# Altium schematic sheet HV PDU.SchDoc
size Letter; DescLong2_DescShort: -
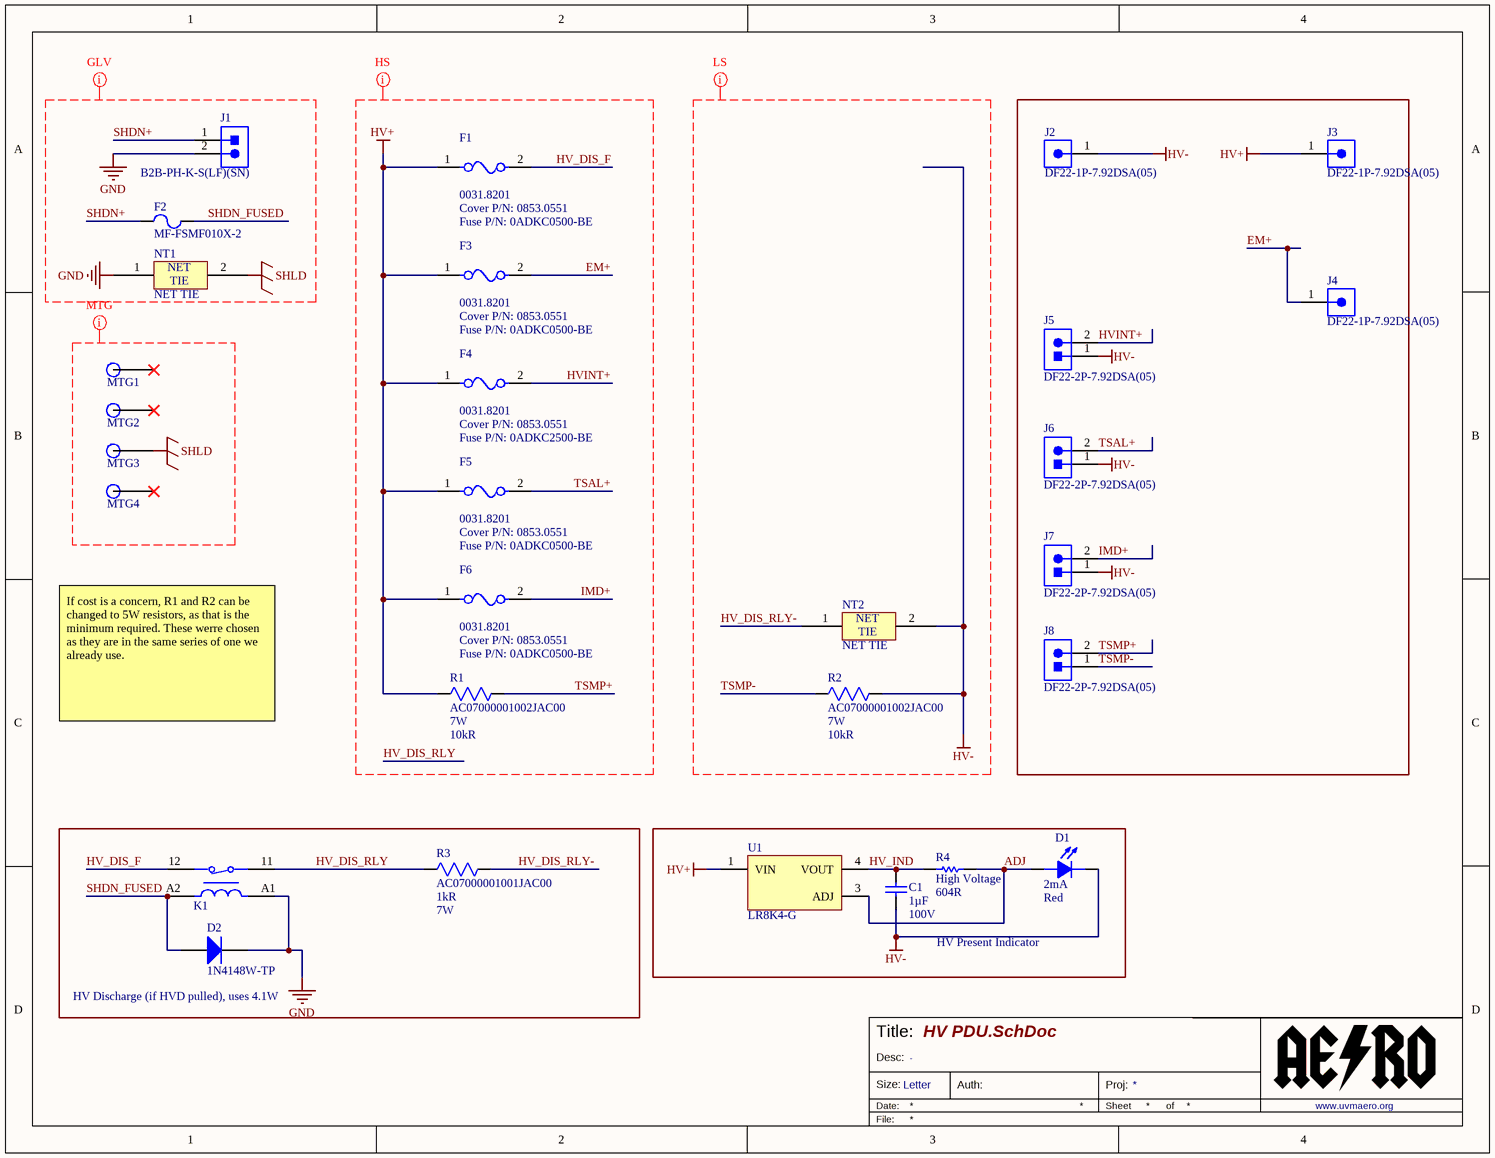
[diagram p0: HV PDU.SchDoc]

## Parts
C1  Capacitance: 1µF  Voltage - Rated: 100V  [CAPC2013X145X20ML20]  (hidden comment: C2012X7S2A105K125AB)
D1  Test Current: 2mA  Color: Red  [LED_5MM]  (hidden comment: WP7113LSECK/J3)
D2  1N4148W-TP  [MCC-SOD123_V]
F1  0031.8201  Cover P/N: 0853.0551  Fuse P/N: 0ADKC0500-BE  [Schurter_0031.8201_ASM]
F2  MF-FSMF010X-2  [MF-FSMF]
F3  0031.8201  Cover P/N: 0853.0551  Fuse P/N: 0ADKC0500-BE  [Schurter_0031.8201_ASM]
F4  0031.8201  Cover P/N: 0853.0551  Fuse P/N: 0ADKC2500-BE  [Schurter_0031.8201_ASM]
F5  0031.8201  Cover P/N: 0853.0551  Fuse P/N: 0ADKC0500-BE  [Schurter_0031.8201_ASM]
F6  0031.8201  Cover P/N: 0853.0551  Fuse P/N: 0ADKC0500-BE  [Schurter_0031.8201_ASM]
J1  B2B-PH-K-S(LF)(SN)  [JST_Sales_America_Inc._B2B-PH-K-S_LF_SN_0]
J2  DF22-1P-7.92DSA(05)  [DF22-1P-7.92DSA(05)]
J3  DF22-1P-7.92DSA(05)  [DF22-1P-7.92DSA(05)]
J4  DF22-1P-7.92DSA(05)  [DF22-1P-7.92DSA(05)]
J5  DF22-2P-7.92DSA(05)  [DF22-2P-7.92DSA_05_0]
J6  DF22-2P-7.92DSA(05)  [DF22-2P-7.92DSA_05_0]
J7  DF22-2P-7.92DSA(05)  [DF22-2P-7.92DSA_05_0]
J8  DF22-2P-7.92DSA(05)  [DF22-2P-7.92DSA_05_0]
K1  1393225-5  [RY553012]  (value not drawn)
MTG1  PCB MTG M3 HV  [MTG-M3-HV]  (value not drawn)  (no BOM)
MTG2  PCB MTG M3 HV  [MTG-M3-HV]  (value not drawn)  (no BOM)
MTG3  PCB MTG M3  [MTG-M3]  (value not drawn)  (no BOM)
MTG4  PCB MTG M3 HV  [MTG-M3-HV]  (value not drawn)  (no BOM)
NT1  NET TIE  [20MIL_TIE]  (net tie, no BOM)
NT2  NET TIE  [60MIL_TIE]  (net tie, no BOM)
R1  AC07000001002JAC00  Power Rating: 7W  Resistance: 10kR  [AC07]
R2  AC07000001002JAC00  Power Rating: 7W  Resistance: 10kR  [AC07]
R3  AC07000001001JAC00  Resistance: 1kR  Power Rating: 7W  [AC07]
R4  Resistance: 604R  [RESC2012X06N_HV]  (hidden comment: KTR10EZPF6040)
U1  LR8K4-G  [Microchip_C04-189_MFG]

## Blocks framed on the sheet
HV Discharge (if HVD pulled), uses 4.1W: D2 K1 R3
HV Present Indicator: C1 D1 R4 U1

## Nets
GND: D2.2(K) J1.2 K1.A1 NT1.1
HV+: F1.1 F3.1 F4.1 F5.1 F6.1 J3.1 R1.1 U1.1(VIN)
HV-: C1.1 D1.K J2.1 J5.1 J6.1 J7.1 NT2.2 R2.2
SHLD: MTG3.1 NT1.2
ADJ: D1.A R4.2 U1.3(ADJ)
EM+: F3.2 J4.1
HV_DIS_F: F1.2 K1.12
HV_DIS_RLY: K1.11 R3.1
HV_DIS_RLY-: NT2.1 R3.2
HV_IND: C1.2 R4.1 U1.4(VOUT)
HVINT+: F4.2 J5.2
IMD+: F6.2 J7.2
SHDN+: F2.1 J1.1
SHDN_FUSED: D2.1(A) F2.2 K1.A2
TSAL+: F5.2 J6.2
TSMP+: J8.2 R1.2
TSMP-: J8.1 R2.1

Not connected (* = marked no-connect by the designer): MTG1 1*; MTG2 1*; MTG4 1*

## Layout directives
net class GLV: GND, SHDN+, SHDN_FUSED, SHLD
net class TS; net class TS+: EM+, HV+, HV_DIS_F, HV_DIS_RLY, HVINT+, IMD+, TSAL+, TSMP+
net class TS; net class TS-: HV-, HV_DIS_RLY-, TSMP-
net class MTG: SHLD

## Notes on the sheet
- If cost is a concern, R1 and R2 can be changed to 5W resistors, as that is the minimum required. These werre chosen as they are in the same series of one we already use.
- Title:
- Size:
- Date:
- Desc:
- Letter
- Auth:
- Sheet
- Proj:
- of
- www.uvmaero.org
- File:
- (in symbol NET TIE) NET; TIE

## Library data of the parts
C1 = C2012X7S2A105K125AB: Chip Capacitor, 1 uF, +/- 10%, 100 V, -55 to 125 degC, 0805 (2012 Metric), RoHS, Tape and Reel; PCN Part Number: MLCCPartNumberChange30/Nov/2012; Manufacturer: TDK; Other Names: 445-5205-1; Online Catalog: CSeries,MidVoltage; Temperature Coefficient: X7S; Featured Product: Compact,High-CapacitanceMultilayerCeramicChipCapacitorsMidVoltageX7S-100VMLCCsC-SeriesMidVoltageMLCCs; Kits: 445-9009-KIT-ND-KITCAPCERHICAP100V-630VSMDSAMPLEKIT1008-ND-KITCAPCERMLCC100V-630V; Catalog Drawings: CSERIES_2012-0805_1.45; Product Training Modules: SEAT,CCV,andTVCLDesignToolsCSeriesMidVoltageCapacitorsFamilyGuidetoReplacinganElectrolyticCapacitorwithanMLCC; Manufacturer URL: http://www.tdk.com/; Series: C; Ratings: -; Datasheet Version: Sep-13; Operating Temperature: -55degC~125degC; Lead Spacing: -; RoHS Information: RoHSCertificate-MLCC; Mounting Type: SurfaceMount,MLCC; Package Reference: 805; Thickness (Max): 0.053"(1.35mm); Category: Capacitors; Lead Style: -; Package Description: 2-Pin Surface Mount Device, Body 2 x 1.25 mm; Family: CeramicCapacitors; Features: -; Applications: GeneralPurpose; Package / Case: 0805(2012Metric); Standard Package: 1; Size / Dimension: 0.079"Lx0.049"W(2.00mmx1.25mm); Height - Seated (Max): -; Datasheet URL: https://datasheet.ciiva.com/24216/c2012x7s2a105k125ab-265082-24216433.pdf; Tolerance: ±10%; Packaging: CutTape(CT); Manufacturer 1: TDK; Manufacturer Part Number 1: C2012X7S2A105K125AB; Supplier 1: Digi-Key; Supplier 2: Arrow; Supplier Part Number 1: 445-5205-1-ND; Supplier Part Number 2: C2012X7S2A105K
D1 = WP7113LSECK/J3: Red 625nm LED Indication - Discrete 1.8V Radial; Manufacturer: Kingbright; Lens Color: Colorless; Lens Transparency: Clear; Luminous Intensity: 550mcd; Viewing Angle: 20°; Case/Package: Radial; Category: LEDs; Dominant Wavelength: 625nm; Forward Voltage: 1.8V; Height: 8.6mm; Lead Free: Lead Free; Manufacturer Part Number: WP7113LSECK/J3; Mount: Through Hole; Packaging: Bulk; Supplier 1: Digi-Key; Supplier Part Number 1: 754-1916-ND
D2 = CMP-2000-04993-1: High Speed Switching Diode, 400 mW, 150 mA, -65 to 150 degC, 2-Pin SOD123, RoHS, Tape and Reel; Manufacturer: Micro Commercial Components; Reverse Recovery Time-Max: 4ns; Average Forward Current-Max: 0.15A; Peak Current-Max: 2A; Power Dissipation: 400mW; Reverse Voltage-Max [Vrrm]: 100V; Datasheet URL: https://datasheet.ciiva.com/16836/1n4148wsod123-16836277.pdf; Package Reference: SOD123; Package URL: http://www.mccsemi.com/up_pdf/1N4448W(SOD-123).pdf; Package Description: 2-Pin Small Outline Diode, Body 2.7 x 1.6 mm, Height 1.35 mm; Manufacturer URL: http://www.mccsemi.com/; Datasheet Version: Rev. C, 07/2014; ClassName: GLV
F1 = 0031.8201: Fuse Block 10A 500V 1 Circuit Cartridge Through Hole; Manufacturer: Schurter; Manufacturer Part Number: 00318201; Approvals: UL,CSA,IEC,EN; Body Material: Thermoplastic; Color: Black; Insulation Resistance: 10MR; Material: Thermoplastic,Tin; Number of Circuits: 1; FuseCurrent: 0.5A; FuseVoltage: 500VDC; FNet: HV_DIS_F; Category: Fuses; Contact Material: Copper Alloy,Tin; Contact Plating: Tin; Depth: 10.8mm; Flammability Rating: UL94 V-0; Lead Free: Lead Free; Length: 25mm; Max Operating Temperature: 85°C; Min Operating Temperature: -40°C; Mount: PCB,Through Hole; Number of Poles: 1; Orientation: Horizontal; Package Quantity: 100; Packaging: Bulk; Radiation Hardening: No; REACH SVHC: No SVHC; Termination: PC Pin; Weight: 0.059966oz; ClassName: TS+_COMP
F2 = MF-FSMF010X-2: Polymeric PTC Resettable Fuse 15V 100mA Ih Surface Mount 0603 (1608 Metric), Concave; Supplier 1: Digi-Key; Supplier Part Number 1: MF-FSMF010X-2CT-ND; ClassName: GLV
F3 = 0031.8201: Fuse Block 10A 500V 1 Circuit Cartridge Through Hole; Manufacturer: Schurter; Manufacturer Part Number: 00318201; Approvals: UL,CSA,IEC,EN; Body Material: Thermoplastic; Color: Black; Illumination Type: Illuminated; Insulation Resistance: 10MR; Material: Thermoplastic,Tin; Number of Circuits: 1; Voltage Rating: 250V; FNet: EM+; FuseCurrent: 0.5A; FuseVoltage: 500VDC; Category: Fuses; Contact Material: Copper Alloy,Tin; Contact Plating: Tin; Current Rating: 10A; Depth: 10.8mm; Flammability Rating: UL94 V-0; Fuse Current: 10A; Lead Free: Lead Free; Length: 25mm; Max Operating Temperature: 85°C; Min Operating Temperature: -40°C; Mount: PCB,Through Hole; Number of Poles: 1; Orientation: Horizontal; Package Quantity: 100; Packaging: Bulk; Radiation Hardening: No; REACH SVHC: No SVHC; Termination: PC Pin; Voltage: 500V; Voltage Rating (AC): 500V; Voltage Rating (DC): 500V; Weight: 0.059966oz; ClassName: TS+_COMP
F4 = 0031.8201: Fuse Block 10A 500V 1 Circuit Cartridge Through Hole; Manufacturer: Schurter; Manufacturer Part Number: 00318201; Approvals: UL,CSA,IEC,EN; Body Material: Thermoplastic; Color: Black; Illumination Type: Illuminated; Insulation Resistance: 10MR; Material: Thermoplastic,Tin; Number of Circuits: 1; Voltage Rating: 250V; FNet: HVINT+; FuseCurrent: 2.5A; FuseVoltage: 500VDC; Category: Fuses; Contact Material: Copper Alloy,Tin; Contact Plating: Tin; Current Rating: 10A; Depth: 10.8mm; Flammability Rating: UL94 V-0; Fuse Current: 10A; Lead Free: Lead Free; Length: 25mm; Max Operating Temperature: 85°C; Min Operating Temperature: -40°C; Mount: PCB,Through Hole; Number of Poles: 1; Orientation: Horizontal; Package Quantity: 100; Packaging: Bulk; Radiation Hardening: No; REACH SVHC: No SVHC; Termination: PC Pin; Voltage: 500V; Voltage Rating (AC): 500V; Voltage Rating (DC): 500V; Weight: 0.059966oz; ClassName: TS+_COMP
F5 = 0031.8201: Fuse Block 10A 500V 1 Circuit Cartridge Through Hole; Manufacturer: Schurter; Manufacturer Part Number: 00318201; Approvals: UL,CSA,IEC,EN; Body Material: Thermoplastic; Color: Black; Illumination Type: Illuminated; Insulation Resistance: 10MR; Material: Thermoplastic,Tin; Number of Circuits: 1; Voltage Rating: 250V; FNet: TSAL+; FuseCurrent: 0.5A; FuseVoltage: 500VDC; Category: Fuses; Contact Material: Copper Alloy,Tin; Contact Plating: Tin; Current Rating: 10A; Depth: 10.8mm; Flammability Rating: UL94 V-0; Fuse Current: 10A; Lead Free: Lead Free; Length: 25mm; Max Operating Temperature: 85°C; Min Operating Temperature: -40°C; Mount: PCB,Through Hole; Number of Poles: 1; Orientation: Horizontal; Package Quantity: 100; Packaging: Bulk; Radiation Hardening: No; REACH SVHC: No SVHC; Termination: PC Pin; Voltage: 500V; Voltage Rating (AC): 500V; Voltage Rating (DC): 500V; Weight: 0.059966oz; ClassName: TS+_COMP
F6 = 0031.8201: Fuse Block 10A 500V 1 Circuit Cartridge Through Hole; Manufacturer: Schurter; Manufacturer Part Number: 00318201; Approvals: UL,CSA,IEC,EN; Body Material: Thermoplastic; Color: Black; Illumination Type: Illuminated; Insulation Resistance: 10MR; Material: Thermoplastic,Tin; Number of Circuits: 1; Voltage Rating: 250V; FNet: IMD+; FuseCurrent: 0.5A; FuseVoltage: 500VDC; Category: Fuses; Contact Material: Copper Alloy,Tin; Contact Plating: Tin; Current Rating: 10A; Depth: 10.8mm; Flammability Rating: UL94 V-0; Fuse Current: 10A; Lead Free: Lead Free; Length: 25mm; Max Operating Temperature: 85°C; Min Operating Temperature: -40°C; Mount: PCB,Through Hole; Number of Poles: 1; Orientation: Horizontal; Package Quantity: 100; Packaging: Bulk; Radiation Hardening: No; REACH SVHC: No SVHC; Termination: PC Pin; Voltage: 500V; Voltage Rating (AC): 500V; Voltage Rating (DC): 500V; Weight: 0.059966oz; ClassName: TS+_COMP
J1 = B2B-PH-K-S(LF)(SN): Connector Header Through Hole 2 position 0.079" (2.00mm); Manufacturer: JST; Manufacturer Part Number: B2BPHKSLFSN; Connector Type: Male Pin; Contact Resistance: 20mR; Current Rating: 2A; Gender: Male; Insulation Resistance: 1MR; Max Voltage Rating (AC): 100V; Number of Contacts: 2; Pitch: 2mm; Category: Connectors; Color: Natural; Contact Material: Brass,Tin; Contact Mating Length: 0.13inch; Contact Plating: Tin,Copper; Depth: 4.5mm; Fastening Type: Detent; Height: 9.4mm; Housing Color: White; Housing Material: Polyamide; Lead Free: Lead Free; Lead Pitch: 2mm; Length: 5.9mm; Max Current Rating: 2A; Max Operating Temperature: 85°C; Max Voltage Rating (DC): 100V; Min Operating Temperature: -25°C; Mount: Through Hole; Number of Pins: 2; Number of Poles: 2; Number of Positions: 2; Number of Rows: 1; Orientation: Straight; Packaging: Bulk; REACH SVHC: No SVHC; Termination: Solder; Voltage Rating: 100V; Voltage Rating (AC): 100V; Width: 4.5mm; Working Voltage: 100V; Supplier 1: Newark; Supplier 2: Digi-Key; Supplier Part Number 1: 37K9940; Supplier Part Number 2: 455-1704-ND; ClassName: GLV
J2-J4 = DF22-1P-7.92DSA(05): Connector Header Through Hole 1 position; Manufacturer: Hirose; Connector Type: Male Pin; Gender: Male; Number of Contacts: 1; Category: Connectors; Color: Beige; Contact Material: Copper Alloy; Contact Mating Length: 0.354inch; Contact Plating: Tin; Fastening Type: Latch; Lead Free: Lead Free; Manufacturer Part Number: DF22-1P-7.92DSA(05); Mount: Through Hole; Number of Positions: 1; Number of Rows: 1; Package Quantity: 100; Packaging: Bulk; REACH SVHC: Unknown; Termination: Solder
J5-J8 = DF22-2P-7.92DSA(05): Connector Header Through Hole 2 position 0.312" (7.92mm); Manufacturer: Hirose; Connector Type: Male Pin; Contact Resistance: 5mR; Current Rating: 25A; Gender: Male; Max Voltage Rating (AC): 1kV; Number of Contacts: 2; Voltage Rating: 600V; Category: Headers and Wire Housings; Color: Beige; Contact Material: Copper Alloy; Contact Mating Length: 0.354inch; Contact Plating: Copper,Tin,Lead; Depth: 12.45mm; Housing Color: Natural; Housing Material: Polyamide; Lead Free: Lead Free; Length: 17.22mm; Manufacturer Part Number: DF22-2P-7.92DSA(05); Max Operating Temperature: 85°C; Min Operating Temperature: -35°C; Mount: Through Hole; Number of Positions: 2; Number of Rows: 1; Orientation: Straight; Package Quantity: 100; Packaging: Bulk; Pitch: 7.92mm; Radiation Hardening: No; REACH SVHC: Unknown; Termination: Solder; Supplier 1: Digi-Key; Supplier Part Number 1: H10714-ND
K1 = 1393225-5: General Purpose Relay SPST-NC (1 Form B) 12VDC Coil Through Hole; Manufacturer: TE Connectivity; Coil Current: 19.2mA; Coil Power: 300mW; Coil Resistance: 627R; Coil Type: Non-Latching; Coil Voltage (DC): 12V; Contact Current Rating: 8A; Contact Voltage Rating (AC): 250V; Dropout Voltage: 1.2V; Operate Time: 9ms; Power Consumption: 230mW; Release Time: 5ms; Throw Configuration: SPST; Voltage Rating (AC): 400V; Category: Power Relays; Contact Material: Tin,Silver; Depth: 10.1mm; ELV: Compliant; Height: 0.484inch; Lead Free: Lead Free; Length: 1.122inch; Manufacturer Part Number: 1393225-5; Max Operating Temperature: 70°C; Min Operating Temperature: -40°C; Mount: Through Hole; Number of Pins: 4; Package Quantity: 20; Packaging: Rail/Tube; Relay Type: General Purpose; Termination: PCB; Weight: 0.282oz; Width: 10.1mm; Supplier 1: Digi-Key; Supplier Part Number 1: PB2762-ND
MTG1 MTG2 MTG4 = MTG M3 HV: PCB Mounting for M3 Screw - HV; P/N: MTG M3 HV; PCB Package: M3
MTG3 = MTG M3: PCB Mounting for M3 Screw; P/N: MTG M3; PCB Package: M3
NT1 NT2 = NET TIE: Net Tie (No BOM)
R1 R2 = AC07000001002JAC00: 10 kOhms ±5% 7W Through Hole Resistor Axial Flame Retardant Coating, Pulse Withstanding, Safety Wirewound; Manufacturer: Vishay BCcomponents; Temperature Coefficient: 180ppm/°C; Voltage Rating: 265V; Case/Package: Axial; Category: Through-Hole Resistors; Composition: Wirewound; Contact Plating: Tin; Diameter: 7.5mm; Features: Flame Retardant Coating; Length: 26mm; Manufacturer Part Number: AC07000001002JAC00; Max Operating Temperature: 200°C; Military Standard: Not; Min Operating Temperature: -40°C; Number of Terminations: 2; Package Quantity: 500; Packaging: Tape and Reel; REACH SVHC: Unknown; Termination: Axial; Tolerance: 5%; Voltage Rating (DC): 265V; Width: 7.49mm; Max Power Dissipation: 7W; Supplier 1: Digi-Key; Supplier Part Number 1: PPC7W10.0KCT-ND
  R1: ClassName: TS+_COMP
  R2: ClassName: TS-_COMP
R3 = AC07000001001JAC00: 1 kOhms ±5% 7W Through Hole Resistor Axial Flame Retardant Coating, Pulse Withstanding, Safety Wirewound; Manufacturer: Vishay BCcomponents; Temperature Coefficient: -80ppm/°C; Voltage Rating: 84V; Case/Package: Axial; Category: Through-Hole Resistors; Composition: Wirewound; Contact Plating: Tin; Diameter: 7.5mm; Features: Flame Retardant Coating; Lead Free: Lead Free; Length: 26mm; Manufacturer Part Number: AC07000001001JAC00; Max Operating Temperature: 200°C; Max Power Dissipation: 7W; Military Standard: Not; Min Operating Temperature: -40°C; Number of Pins: 2; Number of Terminations: 2; Package Quantity: 1; Packaging: Tape and Reel; Radiation Hardening: No; Termination: Axial; Tolerance: 5%; Voltage Rating (DC): 84V; Width: 7.49mm; Supplier 1: Digi-Key; Supplier Part Number 1: PPC7W1.0KCT-ND
R4 = KTR10EZPF6040: 604 Ohms ±1% 0.125W, 1/8W Chip Resistor 0805 (2012 Metric) Automotive AEC-Q200, High Voltage Thick Film; Manufacturer: Rohm; Max Power Dissipation: 125mW; Temperature Coefficient: 100ppm/°C; Width: 0.049inch; Case Code (Imperial): 0805; Case Code (Metric): 2012; Case/Package: 0805; Category: Chip SMD Resistors; Composition: Thick Film; Height: 0.026inch; Length: 0.079inch; Manufacturer Part Number: KTR10EZPF6040; Max Operating Temperature: 155°C; Min Operating Temperature: -55°C; Number of Terminations: 2; Package Quantity: 5000; Packaging: Tape and Reel; Tolerance: 1%; Supplier 1: Digi-Key; Supplier Part Number 1: RHM604AHCT-ND; Features: Automotive AEC-Q200; High Voltage: High Voltage
U1 = LR8K4-G: Linear Voltage Regulator IC Positive Adjustable 1 Output  10mA TO-252, (D-Pak); Supplier 1: Digi-Key; Supplier Part Number 1: LR8K4-GCT-ND